# Altium project 电源.PrjPcb
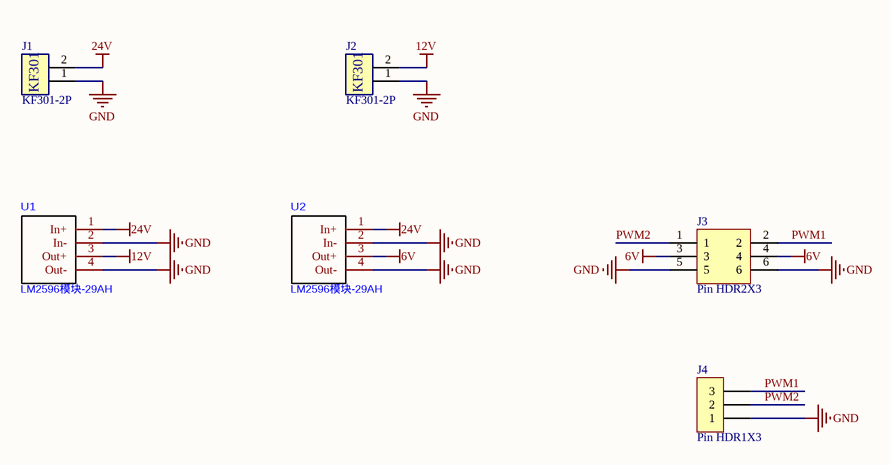
[diagram p0: 电源.SchDoc]
1 sheet, 6 parts. Net scope: global (net labels, ports and power ports of the same name join across sheets).
Board file: 电源.PcbDoc

## Sheet 电源.SchDoc
size A4

### Parts
J1  KF301-2P  [KF301-5.0-2P]
J2  KF301-2P  [KF301-5.0-2P]
J3  Pin HDR2X3  [Pin HDR2X3/2.54mm-S]
J4  Pin HDR1X3  [Pin HDR1X3/2.54mm-S]
U1  LM2596模块-29AH  [LM2596]
U2  LM2596模块-29AH  [LM2596]

### Nets
6V: J3.3 J3.4 U2.3(Out+)
12V: J2.2 U1.3(Out+)
24V: J1.2 U1.1(In+) U2.1(In+)
GND: J1.1 J2.1 J3.5 J3.6 J4.1 U1.2(In-) U1.4(Out-) U2.2(In-) U2.4(Out-)
PWM1: J3.2 J4.3
PWM2: J3.1 J4.2

### Notes on the sheet
- (in symbol KF301-2P) KF301